# Altium schematic sheet 2  - Battery Sensing and Control.SchDoc
size A4
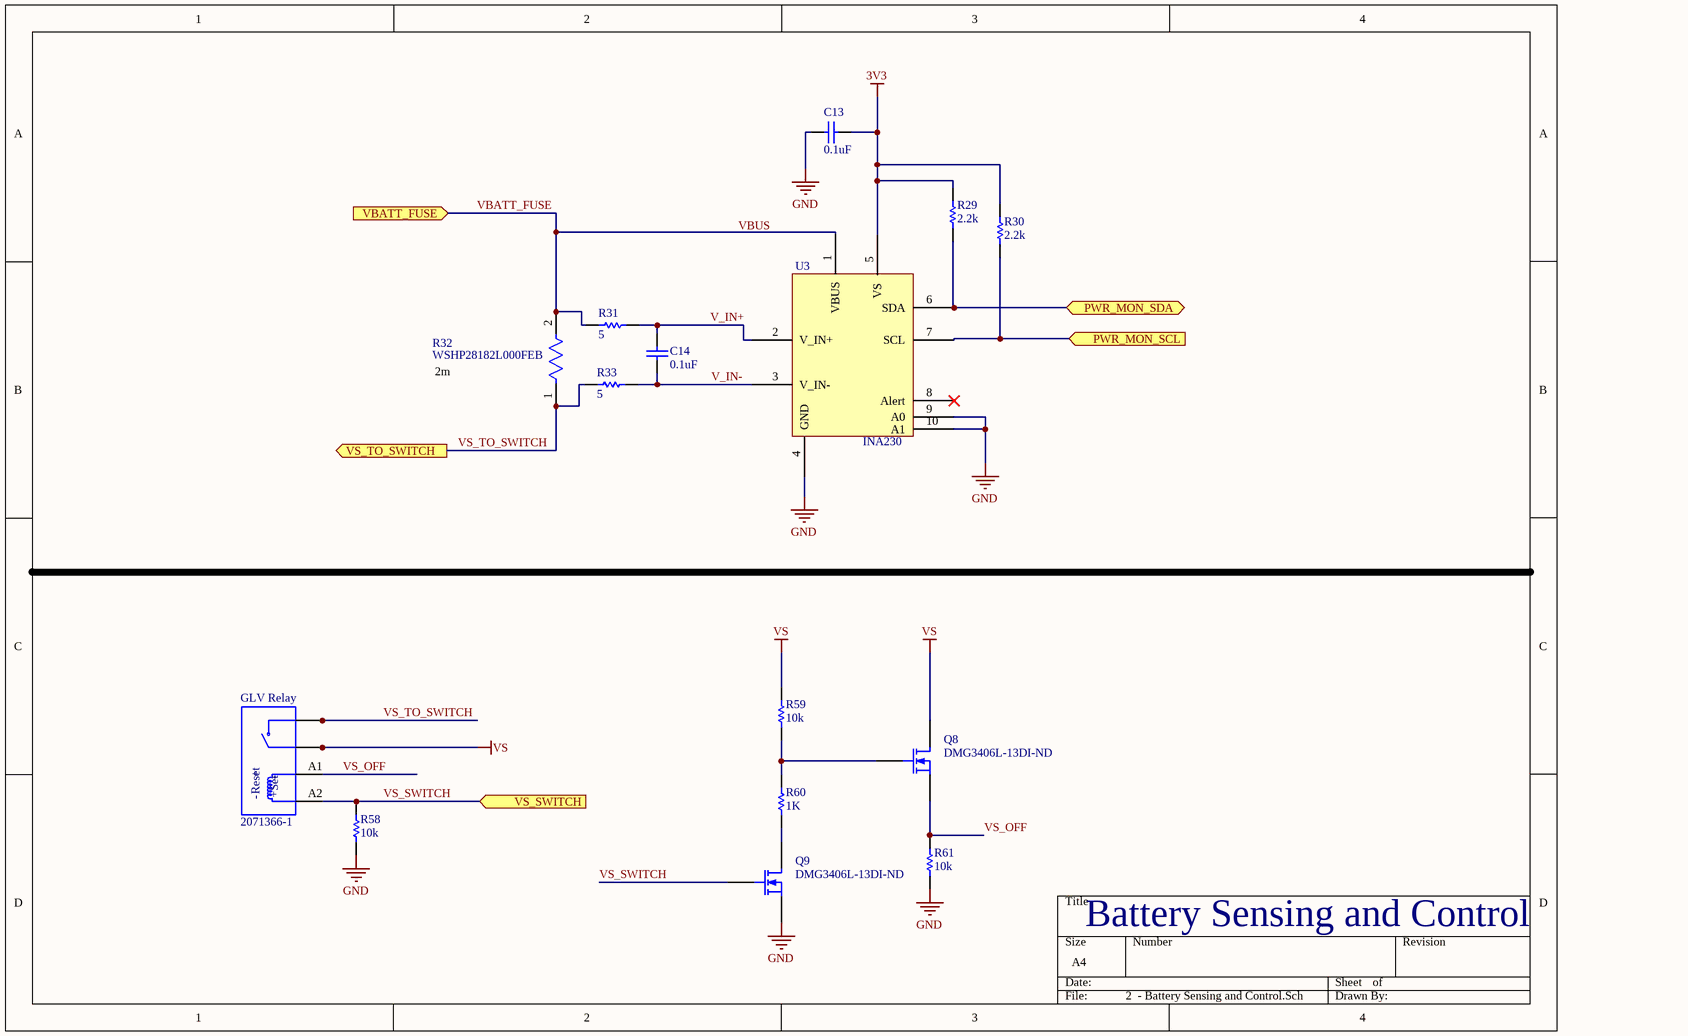
[diagram p0: 2  - Battery Sensing and Control.SchDoc]

## Parts
C13  value 0.1uF  [0603R-generic]  (hidden comment: Cap)
C14  value 0.1uF  [0603R-generic]  (hidden comment: Cap)
GLV_Relay  2071366-1  [TE_2071366-1]
Q8  Supplier Part Number 1: DMG3406L-13DI-ND  [SOT-23_N]
Q9  Supplier Part Number 1: DMG3406L-13DI-ND  [SOT-23_N]
R29  2.2k  [RESC0603(1608)_L]
R30  2.2k  [RESC0603(1608)_L]
R31  5  [RESC0603(1608)_L]
R32  WSHP28182L000FEB  [FP-WSHP2818-MFG]
R33  5  [RESC0603(1608)_L]
R58  10k  [RESC0603(1608)_L]
R59  10k  [RESC0603(1608)_L]
R60  1K  [RESC0603(1608)_L]
R61  10k  [RESC0603(1608)_L]
U3  INA230  [SOP50P490X110-10N]

## Ports
PWR_MON_SCL (in), PWR_MON_SDA (bidir), VBATT_FUSE (in), VS_SWITCH (in), VS_TO_SWITCH (out)

## Nets
3V3: C13.1 R29.2 R30.2 U3.5(VS)
GND: C13.2 Q9.2(S) R58.1 R61.2 U3.4(GND) U3.9(A0) U3.10(A1)
VS: GLV_Relay.4 GLV_Relay.5 GLV_Relay.6 Q8.3(D) R59.1
PWR_MON_SCL: R30.1 U3.7(SCL) ; port PWR_MON_SCL
PWR_MON_SDA: R29.1 U3.6(SDA) ; port PWR_MON_SDA
V_IN+: C14.2 R31.1 U3.2(V_IN+)
V_IN-: C14.1 R33.1 U3.3(V_IN-)
VBATT_FUSE: R31.2 R32.2 U3.1(VBUS) ; port VBATT_FUSE
VS_OFF: GLV_Relay.A1 Q8.2(S) R61.1
VS_SWITCH: GLV_Relay.A2 Q9.1(G) R58.2 ; port VS_SWITCH
VS_TO_SWITCH: GLV_Relay.1 GLV_Relay.2 GLV_Relay.3 R32.1 R33.2 ; port VS_TO_SWITCH
NetQ8_1: Q8.1(G) R59.2 R60.2
NetQ9_3: Q9.3(D) R60.1

Not connected (* = marked no-connect by the designer): U3 8(Alert)*

## Notes on the sheet
- 2m
- Battery Sensing and Control
- Labels drawn without touching a wire or pin: VBUS
- (in symbol 2071366-1) +; -; Reset; Set

## Library data of the parts
C13 C14 = Cap: Capacitor; Manufacturer: Yageo; Manufacturer Part Number: CC1210ZKY5V8BB106; Capacitance: 10µF; Tolerance: -20%, +80%; Voltage - Rated: 25V; Temperature Coefficient: Y5V (F); Supplier 1: Digi-Key; Supplier Part Number 1: 311-2063-1-ND; RoHS: RoHS Compliant; Category: Capacitors; Stock 1: 1156; Pricing 1: 1=0.47, 10=0.323, 25=0.258, 50=0.2154, 100=0.1829, 250=0.14528, 500=0.12912, 1000=0.11298 (CAD); Packaging: Cut Tape (CT); Part Status: Active; Operating Temperature: -30°C ~ 85°C; Features: -; Ratings: -; Applications: General Purpose; Failure Rate: -; Mounting Type: Surface Mount, MLCC; Package / Case: 1210 (3225 Metric); Size / Dimension: 0.126" L x 0.098" W (3.20mm x 2.50mm); Height - Seated (Max): -; Thickness (Max): 0.083" (2.10mm); Lead Spacing: -; Lead Style: -; ComponentLink1URL: http://www.yageo.com/documents/recent/UPY-GPHC_Y5V_6.3V-to-50V_7.pdf; ComponentLink1Description: http://www.yageo.com/documents/recent/UPY-GPHC_Y5V_6.3V-to-50V_7.pdf; Supplier 2: Digi-Key; Supplier Part Number 2: 1276-1869-1-ND
GLV_Relay = 2071366-1: Power Relay, 12Vdc, 60A, Spst-No, Tht; MF: TE Connectivity; MP: EW60-1A3-BL12D04,00000; TE_purchase_URL: https://www.te.com/usa-en/product-2071366-1.html?te_bu=Cor&te_type=disp&te_campaign=seda_glo_cor-seda-global-disp-prtnr-fy19-seda-model-bom-cta_sma-317_1&elqCampaignId=32493; Value: *; SnapEDA_Link: https://www.snapeda.com/parts/EW60-1A3-BL12D04%2C00000/TE%20Connectivity%20Potter%20%26%20Brumfield%20Relays/view-part/2768886/?ref=snap; Digi-Key_Purchase_URL: https://www.digikey.com/product-detail/en/te-connectivity-potter-brumfield-relays/EW60-1A3-BL12D04,00000/PB2134-ND/6021839?utm_source=snapeda&utm_medium=aggregator&utm_campaign=symbol; Package: None; Digi-Key_Part_Number: PB2134-ND
Q8 Q9 = MOSFET-N: N-Channel MOSFET; Manufacturer: Infineon Technologies; Manufacturer Part Number: IPD075N03L G; FET Type: MOSFET N-Channel, Metal Oxide; FET Feature: Logic Level Gate; Drain to Source Voltage (Vdss): 30V; Current - Continuous Drain (Id) @ 25°C: 50A (Tc); Rds On (Max) @ Id, Vgs: 7.5 mOhm @ 30A, 10V; Vgs(th) (Max) @ Id: 2.2V @ 250µA; Gate Charge (Qg) @ Vgs: 18nC @ 10V; Input Capacitance (Ciss) @ Vds: 1900pF @ 15V; Power - Max: 47W; Published: 8-Jun-2000; LatestRevisionDate: 17-Jul-2002; LatestRevisionNote: Re-released for DXP Platform.; PackageVersion: 1995/1996; PackageReference: E3; Publisher: Altium Limited; PackageDescription: TO, Flat Index; 3 In-Line, Axial Leads; Body Dia. 4.6mm; Lead Dia. 0.5 mm (max); RoHS: RoHS Compliant; Category: Discrete Semiconductor Products; Packaging: Cut Tape (CT); Mounting Type: Surface Mount; Package / Case: TO-252-3, DPak (2 Leads + Tab), SC-63; Supplier Device Package: PG-TO252-3; ComponentLink1URL: http://www.infineon.com/dgdl/Infineon-IPD075N03LG-DS-v02_01-en.pdf?folderId=5546d4694909da4801490a07012f053b&fileId=db3a30431936bc4b011951d824f83aeb; ComponentLink1Description: http://www.infineon.com/dgdl/Infineon-IPD075N03LG-DS-v02_01-en.pdf?folderId=5546d4694909da4801490a07012f053b&fileId=db3a30431936bc4b011951d824f83aeb; ComponentLink2URL: http://www.semicon.toshiba.co.jp/info/docget.jsp?type=datasheet&lang=en&pid=SSM3K329R; ComponentLink2Description: http://www.semicon.toshiba.co.jp/info/docget.jsp?type=datasheet&lang=en&pid=SSM3K329R; Supplier 1: Digi-Key
R29-R31 R33 R58-R61 = CMP-1591-00001-1: 0603 (1608 Metric) Chip Resistor; Case-Metric: 1608; Case-EIA: 0603; PackageReference: RESC0603(1608); Supplier 1: Digi-Key; Supplier Part Number 1: P430BZCT-ND
R32 = CMP-00030-78727543-1: WSHP28182L000FEB Res Metal Strip 2818 0.002 Ohm 1% 10W ±200ppm/C Pad SMD Automotive T/R; Temperature Coefficient: 200ppm/°C; Resistance: 2mΩ; Case/Package: 2818; Packaging: Cut Tape; NexarPartId: 78727543; Composition: Metal Element; Height: 3.43mm; Power Rating: 10W; Min Operating Temperature: -65°C; Schedule B: 8533210045, 8533210045; Max Operating Temperature: 170°C; Tolerance: 1%; RoHS: Non-Compliant